# Altium schematic sheet P1.schdoc
size 297 x 209 mm; Symbol: Drawing-Symbol_A4; @Project Name: Worm; @Page Count: 1; @Update Date: 2026-03-06; @Create Date: 2026-02-13; @Schematic Name: Schematic1; @Page No: 1; @Page Name: P1; Company: EasyEDA.com; Version: V1.0; Page Size: A4; @Create Time: 10:29:28; @Update Time: 13:07:42; Border: 1; Width: 1170; Height: 825; Region Start: 1; X Region Count: 6; Y Region Count: 4; Blade Width: 10; Title Block Position: 3; @Board Name: Board1; Device: Drawing-Symbol_A4
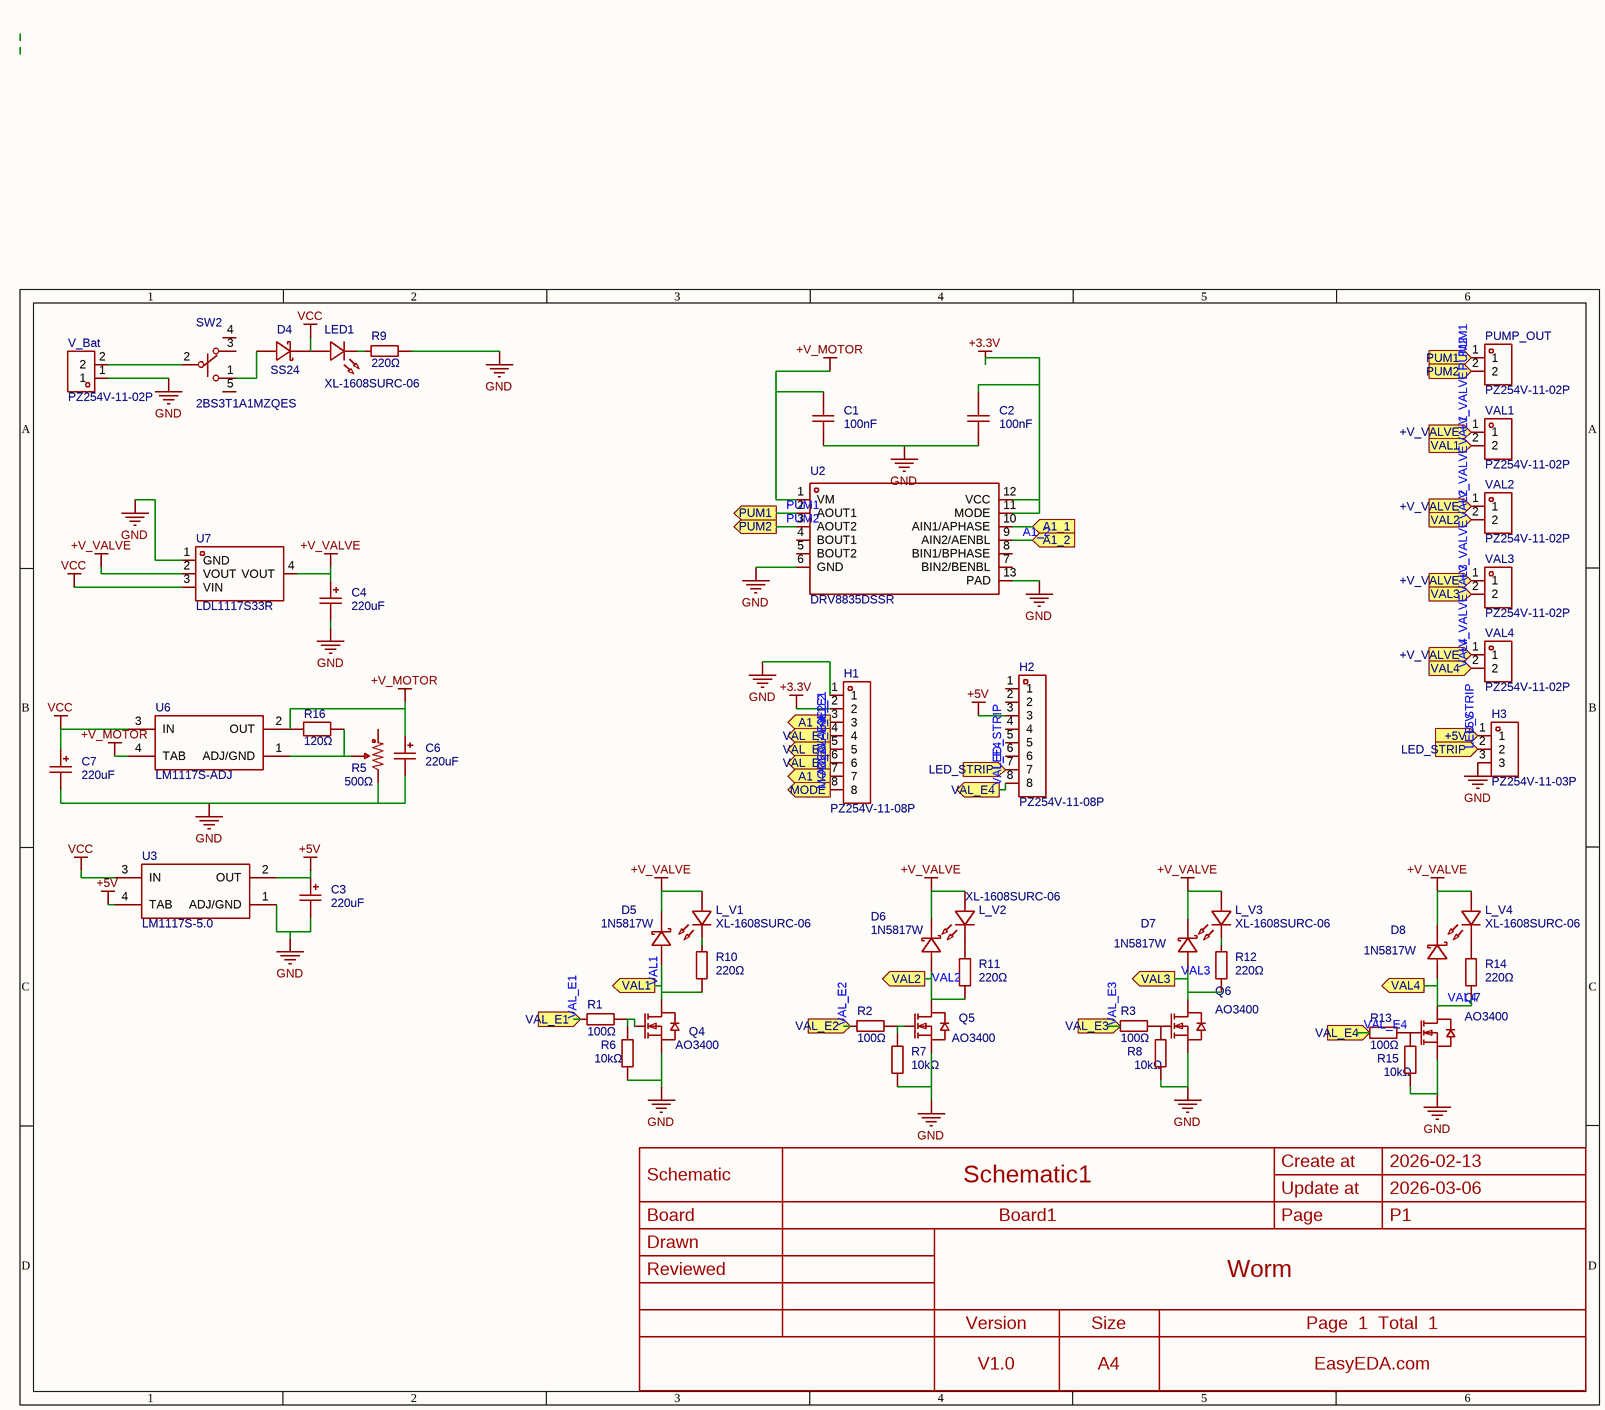
[diagram p0: P1.schdoc]

## Parts
C1  100nF  [C0402]
C2  100nF  [C0402]
C3  220uF  [CASE-B_3528]
C4  220uF  [CASE-B_3528]
C6  220uF  [CASE-B_3528]
C7  220uF  [CASE-B_3528]
D4  SS24  [SMA_L4.3-W2.6-LS5.1-RD]
D5  1N5817W  [SOD-123_L2.7-W1.7-LS3.8-RD]
D6  1N5817W  [SOD-123_L2.7-W1.7-LS3.8-RD]
D7  1N5817W  [SOD-123_L2.7-W1.7-LS3.8-RD]
D8  1N5817W  [SOD-123_L2.7-W1.7-LS3.8-RD]
H1  PZ254V-11-08P  [HDR-TH_8P-P2.54-V-M]
H2  PZ254V-11-08P  [HDR-TH_8P-P2.54-V-M]
H3  PZ254V-11-03P  [HDR-TH_3P-P2.54-V-M_PZ254V-11-03P]
L_V1  XL-1608SURC-06  [LED0603-RD_RED]
L_V2  XL-1608SURC-06  [LED0603-RD_RED]
L_V3  XL-1608SURC-06  [LED0603-RD_RED]
L_V4  XL-1608SURC-06  [LED0603-RD_RED]
LED1  XL-1608SURC-06  [LED0603-RD_RED]
PUMP_OUT  PZ254V-11-02P  [HDR-TH_2P-P2.54-V-M]
Q4  AO3400  [SOT-23-3_L2.9-W1.6-P1.90-LS2.8-BR]
Q5  AO3400  [SOT-23-3_L2.9-W1.6-P1.90-LS2.8-BR]
Q6  AO3400  [SOT-23-3_L2.9-W1.6-P1.90-LS2.8-BR]
Q7  AO3400  [SOT-23-3_L2.9-W1.6-P1.90-LS2.8-BR]
R1  100Ω  [R0402]
R2  100Ω  [R0402]
R3  100Ω  [R0402]
R5  500Ω  [RES-ADJ-SMD_3314G-1-103E]
R6  10kΩ  [R0402]
R7  10kΩ  [R0402]
R8  10kΩ  [R0402]
R9  220Ω  [R0402]
R10  220Ω  [R0402]
R11  220Ω  [R0402]
R12  220Ω  [R0402]
R13  100Ω  [R0402]
R14  220Ω  [R0402]
R15  10kΩ  [R0402]
R16  120Ω  [R0402]
SW2  2BS3T1A1MZQES  [SW-SMD_2BS3T1A1MZQES]
U2  DRV8835DSSR  [WSON-12_L3.0-W2.0-P0.50-BL-EP]
U3  LM1117S-5.0  [SOT-223-3_L6.5-W3.4-P2.30-LS7.0-BR]
U6  LM1117S-ADJ  [SOT-223-3_L6.5-W3.4-P2.30-LS7.0-BR]
U7  LDL1117S33R  [SOT-223-4_L6.5-W3.5-P2.30-LS7.0-BR]
V_Bat  PZ254V-11-02P  [HDR-TH_2P-P2.54-V-M]
VAL1  PZ254V-11-02P  [HDR-TH_2P-P2.54-V-M]
VAL2  PZ254V-11-02P  [HDR-TH_2P-P2.54-V-M]
VAL3  PZ254V-11-02P  [HDR-TH_2P-P2.54-V-M]
VAL4  PZ254V-11-02P  [HDR-TH_2P-P2.54-V-M]

## Ports
+5V (in), +V_VALVE (in), A1_1 (in), A1_1 (out), A1_2 (in), A1_2 (out), LED_STRIP (in), MODE (out), PUM1 (in), PUM1 (out), PUM2 (in), PUM2 (out), VAL1 (in), VAL1 (out), VAL2 (in), VAL2 (out), VAL3 (in), VAL3 (out), VAL4 (in), VAL4 (out), VAL_E1 (in), VAL_E1 (out), VAL_E2 (in), VAL_E2 (out), VAL_E3 (in), VAL_E3 (out), VAL_E4 (in), VAL_E4 (out)

## Nets
+3.3V: C2.2 H1.2 U2.11(MODE) U2.12(VCC)
+5V: C3.1 H2.3 H3.1 U3.2(OUT) U3.4(TAB) ; port +5V
+V_MOTOR: C1.2 C6.1 R16.1 U2.1(VM) U6.2(OUT) U6.4(TAB)
+V_VALVE: C4.1 D5.1(C) D6.1(C) D7.1(C) D8.1(C) L_V1.2(A) L_V2.2(A) L_V3.2(A) L_V4.2(A) U7.2(VOUT) U7.4(VOUT) VAL1.1 VAL2.1 VAL3.1 VAL4.1 ; port +V_VALVE
GND: C1.1 C2.1 C3.2 C4.2 C6.2 C7.2 H1.1 H3.3 Q4.2(S) Q5.2(S) Q6.2(S) Q7.2(S) R5.3 R6.1 R7.1 R8.1 R9.1 R15.1 U2.6(GND) U2.13(PAD) U3.1(ADJ/GND) U7.1(GND) V_Bat.1
VCC: C7.1 D4.1(C) LED1.2(A) U3.3(IN) U6.3(IN) U7.3(VIN)
A1_1: H1.7 U2.10(AIN1/APHASE) ; port A1_1
A1_2: H1.3 U2.9(AIN2/AENBL) ; port A1_2
LED_STRIP: H2.7 H3.2 ; port LED_STRIP
MODE: H1.8 ; port MODE
PUM1: PUMP_OUT.1 U2.2(AOUT1) ; port PUM1
PUM2: PUMP_OUT.2 U2.3(AOUT2) ; port PUM2
VAL1: D5.2(A) Q4.3(D) R10.1 VAL1.2 ; port VAL1
VAL2: D6.2(A) Q5.3(D) R11.1 VAL2.2 ; port VAL2
VAL3: D7.2(A) Q6.3(D) R12.1 VAL3.2 ; port VAL3
VAL4: D8.2(A) Q7.3(D) R14.1 VAL4.2 ; port VAL4
VAL_E1: H1.4 R1.1 ; port VAL_E1
VAL_E2: H1.5 R2.1 ; port VAL_E2
VAL_E3: H1.6 R3.1 ; port VAL_E3
VAL_E4: H2.8 R13.1 ; port VAL_E4
NetD4_2: D4.2(A) SW2.1
NetL_V1_1: L_V1.1(K) R10.2
NetL_V2_1: L_V2.1(K) R11.2
NetL_V3_1: L_V3.1(K) R12.2
NetL_V4_1: L_V4.1(K) R14.2
NetLED1_1: LED1.1(K) R9.2
NetQ4_1: Q4.1(G) R1.2 R6.2
NetQ5_1: Q5.1(G) R2.2 R7.2
NetQ6_1: Q6.1(G) R3.2 R8.2
NetQ7_1: Q7.1(G) R13.2 R15.2
NetR5_2: R5.2 R16.2 U6.1(ADJ/GND)
NetSW2_2: SW2.2 V_Bat.2

Not connected (* = marked no-connect by the designer): H2 1 2 4 5 6; R5 1; SW2 3 4 5; U2 4(BOUT1) 5(BOUT2) 7(BIN2/BENBL) 8(BIN1/BPHASE)

## Notes on the sheet
- Create at
- 2026-02-13
- Schematic
- Board
- Schematic1
- Board1
- Update at
- Page
- 2026-03-06
- P1
- Drawn
- Reviewed
- Worm
- Version
- V1.0
- Size
- A4
- Page  1  Total  1
- EasyEDA.com

## Library data of the parts
C1 C2 = CL05B104KB54PNC: Capacitance:100nF Tolerance:±10% Tolerance:±10% Voltage Rating:50V Temperature Coefficient:X7R; Manufacturer: SAMSUNG(三星); AddInBom: yes; ModelId: b7d13df3e9464d7a99d0651d1a5b4d57; ModelName: C0402_L1.0-W0.5-H0.5; ModelTransform: 39.37,19.685,0,0,0,0,0,0,0; Tolerance: ±10%; Voltage Rating: 50V; Temperature Coefficient: X7R; Device: CL05B104KB54PNC; Symbol: CL05B104KB54PNC; LCSC Part Name: 100nF ±10% 50V; SupplierPart: C307331; ManufacturerPart: CL05B104KB54PNC; Supplier Footprint: 0402; JLCPCB Part Class: Basic Part; Datasheet: https://item.szlcsc.com/datasheet/CL05B104KB54PNC/291005.html; Supplier: LCSC; ConvertToPcb: yes; FootprintName: C0402; Value: 100nF
C3 C4 C6 C7 = TLJB227M006R0500: Capacitance:220uF Tolerance:±20% Tolerance:±20% Voltage Rating:6.3V Equivalent Series Resistance(ESR):500mΩ@100kHz Operating Temperature:-55℃~+125℃ Operating Temperature:-55℃~+125℃; Manufacturer: Kyocera AVX; AddInBom: yes; ModelId: fcfe77907b4c4657a633363937ce9b62; ModelName: CASE-B_L3.5-W2.8-H1.9; ModelTransform: 145.669,110.236,0,0,0,0,0,0,0; Tolerance: ±20%; Voltage Rating: 6.3V; Symbol: TLJB227M006R0500; Device: TLJB227M006R0500; LCSC Part Name: 220uF ±20% 6.3V; SupplierPart: C30242; ManufacturerPart: TLJB227M006R0500; Supplier Footprint: CASE-B-3528-21(mm); JLCPCB Part Class: Extended Part; Supplier: LCSC; ConvertToPcb: yes; FootprintName: CASE-B_3528; Value: 220uF; Equivalent Series Resistance(ESR): 500mΩ@100kHz; Operating Temperature: -55℃~+125℃
D4 = SS24_C7428177: Diode Configuration:1 Independent Voltage - Forward(Vf@If):550mV@2A Voltage - DC Reverse(Vr):40V Current - Rectified:2A Reverse Leakage Current (Ir):100uA Operating Junction Temperature Range:-55℃~+125℃ Operating Junction Temperature Range:-55℃~+125℃; Manufacturer: NH(纽航); AddInBom: yes; ModelId: 9f0f28a3f5e244ceb50a0213b7a9858d; ModelTransform: 196.4563,102.362,0,0,0,0,0.001,-0.001,0; Voltage - DC Reverse(Vr): 40V; Current - Rectified: 2A; Reverse Leakage Current (Ir): 100uA; Symbol: SS24_C7428177; Device: SS24_C7428177; LCSC Part Name: 电压:40V 电流:2A; SupplierPart: C7428177; ManufacturerPart: SS24; Supplier Footprint: SMA; JLCPCB Part Class: Extended Part; Datasheet: https://item.szlcsc.com/datasheet/SS24/8422526.html; Supplier: LCSC; ConvertToPcb: yes; FootprintName: SMA_L4.3-W2.6-LS5.1-RD; ModelName: SMA_L4.3-W2.6-LS5.1-RD; Diode Configuration: 1 Independent; Voltage - Forward(Vf@If): 550mV@2A; Operating Junction Temperature Range: -55℃~+125℃
D5-D8 = 1N5817W_C49238183: Voltage - Forward(Vf@If):750mV@3.0A Voltage - DC Reverse(Vr):20V Current - Rectified:1A Reverse Leakage Current (Ir):25A Operating Junction Temperature Range:-55℃~+150℃ Operating Junction Temperature Range:-55℃~+150℃ Non-Repetitive Peak Forward Surge Curr; Manufacturer: Hottech(合科泰); AddInBom: yes; ModelId: 619603fa8f4b456cbd6047d9f8e47121; ModelTransform: 145.669,64.961,0,0,0,0,0,0,0; Voltage - DC Reverse(Vr): 20V; Current - Rectified: 1A; Reverse Leakage Current (Ir): 25A; Symbol: 1N5817W_C49238183; Device: 1N5817W_C49238183; LCSC Part Name: 20V 1A; SupplierPart: C49238183; ManufacturerPart: 1N5817W; Supplier Footprint: SOD-123; JLCPCB Part Class: Extended Part; Datasheet: https://item.szlcsc.com/datasheet/1N5817W/51659701.html; Supplier: LCSC; ConvertToPcb: yes; FootprintName: SOD-123_L2.7-W1.7-LS3.8-RD; ModelName: SOD-123_L2.7-W1.7-LS3.8-RD; Voltage - Forward(Vf@If): 750mV@3.0A; Operating Junction Temperature Range: -55℃~+150℃; Non-Repetitive Peak Forward Surge Current: 25A
H1 H2 = PZ254V-11-08P: Pin Structure:1x8P Pitch:2.54mm Row Spacing:- Circluar Pins/Square Pins:Pin Header Mounting Type:Through Hole Number of Rows:1 Number of Pins:8P Current Rating:- Voltage Rating (Max):- Length of Mating Pin:6mm Insulation Height:2.5mm Length of End Connect; Manufacturer: XFCN(兴飞); AddInBom: yes; ModelId: 926dcf5c05be473f8295f20cc8ccf72f; ModelTransform: 807.87244,98.425,0,0,0,0,0,0,-118.11; Pin Structure: 1x8P; Pitch: 2.54mm; Symbol: PZ254V-11-08P; Supplier Part: C27438; Device: PZ254V-11-08P; LCSC Part Name: 1x8P 间距:2.54mm 方针 直插; ManufacturerPart: PZ254V-11-08P; Supplier Footprint: 插件,P=2.54mm; JLCPCB Part Class: Extended Part; Datasheet: https://item.szlcsc.com/datasheet/PZ254V-11-08P/502963.html; Supplier: LCSC; ConvertToPcb: yes; FootprintName: HDR-TH_8P-P2.54-V-M; ModelName: HDR-TH_8P-P2.54-V-M; Row Spacing: -; Circluar Pins/Square Pins: Pin Header; Mounting Type: Through Hole; Number of Rows: 1; Number of Pins: 8P; Current Rating: -; Voltage Rating (Max): -; Length of Mating Pin: 6mm; Insulation Height: 2.5mm; Length of End Connection Pin: 3mm; Contact Material: Brass; Contact Plating: -; Operating Temperature: -40℃~+105℃; Color: Black
H3 = PZ254V-11-03P: Pin Structure:1x3P Pitch:2.54mm Row Spacing:- Circluar Pins/Square Pins:Pin Header Mounting Type:Through Hole Number of Rows:1 Number of Pins:3P Current Rating:3A Voltage Rating (Max):250V Length of Mating Pin:6mm Insulation Height:2.5mm Length of End Con; Manufacturer: XFCN(兴飞); Symbol: PZ254V-11-03P_C2937625; AddInBom: yes; ModelId: bd28a638fbd247be9398fd5d39c366ec; ModelTransform: 300.3931,100,0,0,0,0,0,0,-118.11; Pin Structure: 1x3P; Pitch: 2.54mm; Current Rating: 3A; Voltage Rating (Max): 250V; Device: PZ254V-11-03P; LCSC Part Name: 1x3P 间距:2.54mm 方针 直插; SupplierPart: C2937625; ManufacturerPart: PZ254V-11-03P; Supplier Footprint: 插件,P=2.54mm; JLCPCB Part Class: Extended Part; Datasheet: https://item.szlcsc.com/datasheet/PZ254V-11-03P/3293280.html; Supplier: LCSC; ConvertToPcb: yes; FootprintName: HDR-TH_3P-P2.54-V-M_PZ254V-11-03P; ModelName: HDR-TH_3P-P2.54-V-M_PZ254V-11-03P; Row Spacing: -; Circluar Pins/Square Pins: Pin Header; Mounting Type: Through Hole; Number of Rows: 1; Number of Pins: 3P; Length of Mating Pin: 6mm; Insulation Height: 2.5mm; Length of End Connection Pin: 3mm; Operating Temperature: -40℃~+105℃; Color: Black
L_V1-L_V4 LED1 = XL-1608SURC-06: Lamp Holder Type:- Illumination Color:Red Voltage - Forward(Vf):2.3V Voltage - Forward(Vf):2.3V Power(Watts):50mW Forward Current:20mA Wavelength - Dominant:620nm~630nm Wavelength - Dominant:620nm~630nm Peak Wavelength:625nm Diode Configuration:- Lens Col; Manufacturer: XINGLIGHT(成兴光); AddInBom: yes; ModelId: 5eb0caa4a4a8448d821f86e8aa7b6b2f; ModelTransform: 63.7794,31.496,0,0,0,0,0,-0.002,0; Illumination Color: Red; Voltage - Forward(Vf): 2.3V; Power(Watts): 50mW; Forward Current: 20mA; Peak Wavelength: 625nm; Lens Color: Water Clear; Luminous Intensity: 225mcd; Viewing Angle: 120°; Symbol: XL-1608SURC-06; Device: XL-1608SURC-06; LCSC Part Name: 0603红色贴片式发光二极管; SupplierPart: C965799; ManufacturerPart: XL-1608SURC-06; Supplier Footprint: 0603; JLCPCB Part Class: Extended Part; Datasheet: https://item.szlcsc.com/datasheet/XL-1608SURC-06/1051408.html; Supplier: LCSC; ConvertToPcb: yes; FootprintName: LED0603-RD_RED; ModelName: LED0603-RD_RED; Lamp Holder Type: -; Wavelength - Dominant: 620nm~630nm; Diode Configuration: -; Color Temperature: -; Mounting Style: Top-mount; Operating Temperature: -40℃~+85℃
PUMP_OUT V_Bat VAL1-VAL4 = PZ254V-11-02P: Pin Structure:1x2P Pitch:2.54mm Row Spacing:- Circluar Pins/Square Pins:Pin Header Mounting Type:Through Hole Number of Rows:1 Number of Pins:2P Current Rating:- Voltage Rating (Max):- Length of Mating Pin:6mm Insulation Height:2.5mm Length of End Connect; Manufacturer: XFCN(兴飞); Symbol: ZX-XH2.54-2PZZ; AddInBom: yes; ModelId: b9a02bffb1e248eabf92e8e2aa859dc0; ModelName: HDR2.54-M-LI-1X2P; ModelTransform: 200,100,0,0,0,0,0,0,-118.11; Pin Structure: 1x2P; Pitch: 2.54mm; Device: PZ254V-11-02P; LCSC Part Name: 1x2P 间距:2.54mm 方针 直插; SupplierPart: C492401; ManufacturerPart: PZ254V-11-02P; Supplier Footprint: 插件,P=2.54mm; JLCPCB Part Class: Extended Part; Datasheet: https://item.szlcsc.com/datasheet/PZ254V-11-02P/502957.html; Supplier: LCSC; ConvertToPcb: yes; FootprintName: HDR-TH_2P-P2.54-V-M; Row Spacing: -; Circluar Pins/Square Pins: Pin Header; Mounting Type: Through Hole; Number of Rows: 1; Number of Pins: 2P; Current Rating: -; Voltage Rating (Max): -; Length of Mating Pin: 6mm; Insulation Height: 2.5mm; Length of End Connection Pin: 3mm; Contact Material: Brass; Contact Plating: -; Operating Temperature: -40℃~+105℃; Color: Black
Q4-Q7 = AO3400_C50176479: Drain to Source Voltage:30V Current - Continuous Drain(Id):5.8A RDS(on):24mΩ@10V Pd - Power Dissipation:1.4W Gate Threshold Voltage (Vgs(th)):1.3V Gate Charge(Qg):9.1nC@4.5V Input Capacitance(Ciss):507pF Reverse Transfer Capacitance (Crss@Vds):43pF Operat; Manufacturer: SEP(威旺); AddInBom: yes; ModelId: 4eed685bb9f4439b846746bc2193f3c0; ModelName: SOT-23-3L_L2.9-W1.6-H1.1-LS2.8-P0.95; ModelTransform: 114.173,110.236,0,90,0,0,0,0,0; Drain to Source Voltage: 30V; Current - Continuous Drain(Id): 5.8A; Pd - Power Dissipation: 1.4W; Gate Threshold Voltage (Vgs(th)): 1.3V; Input Capacitance(Ciss): 507pF; Reverse Transfer Capacitance (Crss@Vds): 43pF; Type: N-Channel; Output Capacitance(Coss): 52pF; Symbol: AO3400_C50176479; Device: AO3400_C50176479; LCSC Part Name: AO3400; SupplierPart: C50176479; ManufacturerPart: AO3400; Supplier Footprint: SOT-23; JLCPCB Part Class: Extended Part; Datasheet: https://item.szlcsc.com/datasheet/AO3400/52750369.html; Supplier: LCSC; ConvertToPcb: yes; FootprintName: SOT-23-3_L2.9-W1.6-P1.90-LS2.8-BR; RDS(on): 24mΩ@10V; Gate Charge(Qg): 9.1nC@4.5V; Operating Temperature: -55℃~+150℃
R1-R3 R13 = FRC0402F1000TS: Type:Thick Film Resistor Resistance:100Ω Tolerance:±1% Tolerance:±1% Power(Watts):62.5mW Voltage-Supply(Max):50V Temperature Coefficient:±100ppm/℃ Temperature Coefficient:±100ppm/℃ Operating Temperature:-55℃~+155℃ Operating Temperature:-55℃~+155℃; Manufacturer: FOJAN(富捷); Symbol: Res; AddInBom: yes; ModelId: efdecb7dae4442949d28eecaf748420f; ModelName: R0402_L1.0-W0.5-H0.4; ModelTransform: 39.37,19.685,0,0,0,0,0,0,0; Tolerance: ±1%; Power(Watts): 62.5mW; Voltage-Supply(Max): 50V; Device: FRC0402F1000TS; LCSC Part Name: 100Ω ±1% 62.5mW 厚膜电阻; SupplierPart: C2906860; ManufacturerPart: FRC0402F1000TS; Supplier Footprint: 0402; JLCPCB Part Class: Extended Part; Supplier: LCSC; ConvertToPcb: yes; FootprintName: R0402; Type: Thick Film Resistor; Value: 100Ω; Temperature Coefficient: ±100ppm/℃; Operating Temperature: -55℃~+155℃
R5 = 3314G-1-501E: Resistance: Tolerance:±20% Tolerance:±20% Rated Voltage:- Power(Watts):250mW Temperature Coefficient:±100ppm/℃ Temperature Coefficient:±100ppm/℃ Turns:; Manufacturer: BOURNS; Symbol: TC33X-2-103E; AddInBom: yes; ModelId: 88ce3f755cce4f188c33851074b1dbf9; ModelTransform: 177.165,244.094,0,0,0,0,0,0,0; Tolerance: ±20%; Power(Watts): 250mW; Device: 3314G-1-501E; LCSC Part Name: 500Ω ±20%; SupplierPart: C780216; ManufacturerPart: 3314G-1-501E; Supplier Footprint: SMD-3P,4.5x4.5mm; JLCPCB Part Class: Extended Part; Datasheet: https://atta.szlcsc.com/upload/public/pdf/source/20200907/C711704_9E01BBE91A77C04D4BA3112A60EB8AD1.pdf; Supplier: LCSC; ConvertToPcb: yes; FootprintName: RES-ADJ-SMD_3314G-1-103E; ModelName: RES-ADJ-SMD_3314G-1-103E; Value: 500Ω; Rated Voltage: -; Temperature Coefficient: ±100ppm/℃
R6-R8 R15 = FRC0402J103 TS: Type:Thick Film Resistor Resistance:10kΩ Tolerance:±5% Tolerance:±5% Power(Watts):62.5mW Voltage-Supply(Max):50V Temperature Coefficient:±100ppm/℃ Temperature Coefficient:±100ppm/℃ Operating Temperature:-55℃~+155℃ Operating Temperature:-55℃~+155℃; Manufacturer: FOJAN(富捷); Symbol: Res; AddInBom: yes; ModelId: efdecb7dae4442949d28eecaf748420f; ModelName: R0402_L1.0-W0.5-H0.4; ModelTransform: 39.37,19.685,0,0,0,0,0,0,0; Tolerance: ±5%; Power(Watts): 62.5mW; Voltage-Supply(Max): 50V; Device: FRC0402J103 TS; LCSC Part Name: 10kΩ ±5% 62.5mW 厚膜电阻; SupplierPart: C2906885; ManufacturerPart: FRC0402J103 TS; Supplier Footprint: 0402; JLCPCB Part Class: Extended Part; Supplier: LCSC; ConvertToPcb: yes; FootprintName: R0402; Type: Thick Film Resistor; Value: 10kΩ; Temperature Coefficient: ±100ppm/℃; Operating Temperature: -55℃~+155℃
R9-R12 R14 = FRC0402F2200TS: Type:Thick Film Resistor Resistance:220Ω Tolerance:±1% Tolerance:±1% Power(Watts):62.5mW Voltage-Supply(Max):50V Temperature Coefficient:±100ppm/℃ Temperature Coefficient:±100ppm/℃ Operating Temperature:-55℃~+155℃ Operating Temperature:-55℃~+155℃; Manufacturer: FOJAN(富捷); Symbol: Res; AddInBom: yes; ModelId: efdecb7dae4442949d28eecaf748420f; ModelName: R0402_L1.0-W0.5-H0.4; ModelTransform: 39.37,19.685,0,0,0,0,0,0,0; Tolerance: ±1%; Power(Watts): 62.5mW; Voltage-Supply(Max): 50V; Device: FRC0402F2200TS; LCSC Part Name: 220Ω ±1% 62.5mW 厚膜电阻; SupplierPart: C2909336; ManufacturerPart: FRC0402F2200TS; Supplier Footprint: 0402; JLCPCB Part Class: Extended Part; Datasheet: https://item.szlcsc.com/datasheet/FRC0402F2200TS/3186271.html; Supplier: LCSC; ConvertToPcb: yes; FootprintName: R0402; Type: Thick Film Resistor; Value: 220Ω; Temperature Coefficient: ±100ppm/℃; Operating Temperature: -55℃~+155℃
R16 = FRC0402F1200TS: Type:Thick Film Resistor Resistance:120Ω Tolerance:±1% Tolerance:±1% Power(Watts):62.5mW Voltage-Supply(Max):50V Temperature Coefficient:±100ppm/℃ Temperature Coefficient:±100ppm/℃ Operating Temperature:-55℃~+155℃ Operating Temperature:-55℃~+155℃; Manufacturer: FOJAN(富捷); AddInBom: yes; ModelId: efdecb7dae4442949d28eecaf748420f; ModelName: R0402_L1.0-W0.5-H0.4; ModelTransform: 39.37,19.685,0,0,0,0,0,0,0; Tolerance: ±1%; Power(Watts): 62.5mW; Voltage-Supply(Max): 50V; Symbol: FRC0402F1200TS; Device: FRC0402F1200TS; LCSC Part Name: 120Ω ±1% 62.5mW 厚膜电阻; SupplierPart: C2909315; ManufacturerPart: FRC0402F1200TS; Supplier Footprint: 0402; JLCPCB Part Class: Extended Part; Datasheet: https://item.szlcsc.com/datasheet/FRC0402F1200TS/3186250.html; Supplier: LCSC; ConvertToPcb: yes; FootprintName: R0402; Type: Thick Film Resistor; Value: 120Ω; Temperature Coefficient: ±100ppm/℃; Operating Temperature: -55℃~+155℃
SW2 = 2BS3T1A1MZQES: Circuit:SPDT Life:30,000 Cycles Actuator Type:Cylinder Lever Termination Style:SMD(SMT) Tab Mounting Type:Surface Mount, Right Angle Operating Temperature:-30℃~+85℃ Operating Temperature:-30℃~+85℃; Manufacturer: Dailywell(德利威); AddInBom: yes; ModelId: 2372c53925034abf8887eacb469f47c2; ModelTransform: 320.0781,828.7385,0,0,0,0,0.001,-185.038,0; Circuit: SPDT; Symbol: 2BS3T1A1MZQES; Device: 2BS3T1A1MZQES; LCSC Part Name: 2B系列 钮子开关 摇头开关; SupplierPart: C908288; ManufacturerPart: 2BS3T1A1MZQES; Supplier Footprint: SMD; JLCPCB Part Class: Extended Part; Datasheet: https://item.szlcsc.com/datasheet/2BS3T1A1MZQES/974707.html; Supplier: LCSC; ConvertToPcb: yes; FootprintName: SW-SMD_2BS3T1A1MZQES; ModelName: SW-SMD_2BS3T1A1MZQES; Life: 30,000 Cycles; Actuator Type: Cylinder Lever; Termination Style: SMD(SMT) Tab; Mounting Type: Surface Mount, Right Angle; Operating Temperature: -30℃~+85℃
U2 = DRV8835DSSR: Manufacturer: TI(德州仪器); AddInBom: yes; ModelId: cd0a0201d7d74912b3d471423687075e; ModelName: WSON-12_L3.0-W2.0-H0.8-P0.50; ModelTransform: 79.527,118.8974,0,90,0,0,0,0,0; Symbol: DRV8835DSSR; Device: DRV8835DSSR; LCSC Part Name: DRV8835 双通道低压H桥IC; SupplierPart: C129328; ManufacturerPart: DRV8835DSSR; Supplier Footprint: WSON-12-EP(2x3); JLCPCB Part Class: Extended Part; Datasheet: https://www.ti.com/cn/lit/gpn/drv8835; Supplier: LCSC; ConvertToPcb: yes; FootprintName: WSON-12_L3.0-W2.0-P0.50-BL-EP
U3 = LM1117S-5.0: Output Type:Fixed Voltage - Supply:12V Output Voltage:5V Output Voltage:5V Output Current:1A Power Supply Rejection Ratio (PSRR):75dB@(120Hz) Voltage Dropout:1.2V@(1A) standby current:5mA Noise:100uV Features:Over Temperature Protection Operating Temperat; Manufacturer: HTC; AddInBom: yes; ModelId: e5f8b32b785646b6abbef6d5ae2fe060; ModelName: SOT-223-4P_L6.5-W3.5-H1.6-LS7.0-P2.30; ModelTransform: 279.89794,255.905,0,180,0,0,-3.9385,-0.0005,0; Output Type: Fixed; Voltage - Supply: 12V; Output Voltage: 5V; standby current: 5mA; Noise: 100uV; Output Configuration: Positive; Number of Outputs: 1; Symbol: LM1117S-5.0; Device: LM1117S-5.0; LCSC Part Name: 5V 1A 12V; SupplierPart: C126028; ManufacturerPart: LM1117S-5.0; Supplier Footprint: SOT-223-3; JLCPCB Part Class: Extended Part; Datasheet: https://item.szlcsc.com/datasheet/LM1117S-5.0/137308.html; Supplier: LCSC; ConvertToPcb: yes; FootprintName: SOT-223-3_L6.5-W3.4-P2.30-LS7.0-BR; Output Current: 1A; Power Supply Rejection Ratio (PSRR): 75dB@(120Hz); Voltage Dropout: 1.2V@(1A); Features: Over Temperature Protection; Operating Temperature: -40℃~+125℃@(Tj)
U6 = LM1117S-ADJ: Output Type:Adjustable Voltage - Supply:12V Output Voltage:1.238V~1.281V Output Voltage:1.238V~1.281V Output Current:1A Power Supply Rejection Ratio (PSRR):75dB@(120Hz) Voltage Dropout:1.2V@(1A) standby current:- Noise:- Features:Over Temperature Protecti; Manufacturer: HTC; AddInBom: yes; ModelId: e5f8b32b785646b6abbef6d5ae2fe060; ModelName: SOT-223-4P_L6.5-W3.5-H1.6-LS7.0-P2.30; ModelTransform: 279.89794,255.905,0,180,0,0,-3.9385,-0.0005,0; Voltage - Supply: 12V; Output Configuration: Positive; Number of Outputs: 1; Symbol: LM1117S-ADJ; Device: LM1117S-ADJ; LCSC Part Name: 1A低压差线性稳压器; SupplierPart: C126029; ManufacturerPart: LM1117S-ADJ; Supplier Footprint: SOT-223; JLCPCB Part Class: Extended Part; Datasheet: https://item.szlcsc.com/datasheet/LM1117S-ADJ/137309.html; Supplier: LCSC; ConvertToPcb: yes; FootprintName: SOT-223-3_L6.5-W3.4-P2.30-LS7.0-BR; Output Type: Adjustable; Output Voltage: 1.238V~1.281V; Output Current: 1A; Power Supply Rejection Ratio (PSRR): 75dB@(120Hz); Voltage Dropout: 1.2V@(1A); standby current: -; Noise: -; Features: Over Temperature Protection; Operating Temperature: -40℃~+125℃@(Tj)
U7 = LDL1117S33R: Output Type:Fixed Voltage - Supply:18V Output Voltage:3.3V Output Voltage:3.3V Output Current:1.2A Power Supply Rejection Ratio (PSRR):87dB@(120Hz) Voltage Dropout:600mV@(1.2A) standby current:500uA Noise:60uVrms Features:Over Temperature Protection；Over; Manufacturer: ST(意法半导体); AddInBom: yes; ModelId: e5f8b32b785646b6abbef6d5ae2fe060; ModelName: SOT-223-4P_L6.5-W3.5-H1.6-LS7.0-P2.30; ModelTransform: 279.89794,255.905,0,180,0,0,-0.0005,-0.0005,0; Output Type: Fixed; Voltage - Supply: 18V; Output Voltage: 3.3V; standby current: 500uA; Output Configuration: Positive; Number of Outputs: 1; Symbol: LDL1117S33R; Device: LDL1117S33R; LCSC Part Name: 输入18V 输出3.3V 1.2A; SupplierPart: C435835; ManufacturerPart: LDL1117S33R; Supplier Footprint: SOT-223-4; JLCPCB Part Class: Extended Part; Datasheet: https://item.szlcsc.com/datasheet/LDL1117S33R/433206.html; Supplier: LCSC; ConvertToPcb: yes; FootprintName: SOT-223-4_L6.5-W3.5-P2.30-LS7.0-BR; Output Current: 1.2A; Power Supply Rejection Ratio (PSRR): 87dB@(120Hz); Voltage Dropout: 600mV@(1.2A); Noise: 60uVrms; Features: Over Temperature Protection；Over Current Protection；Thermal Shutdown; Operating Temperature: -40℃~+125℃@(Tj)